# EasyEDA schematic table2.json
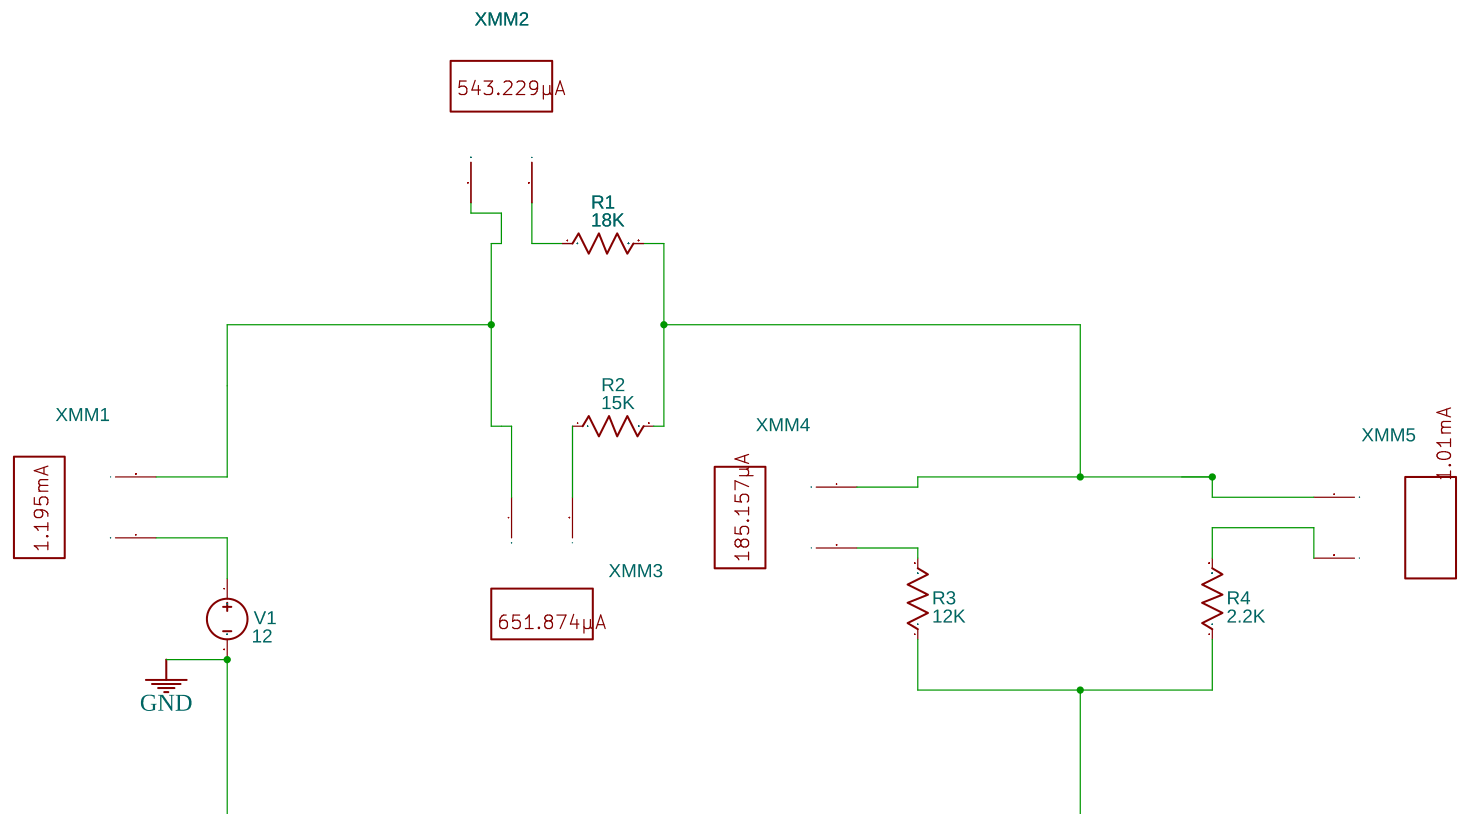
[diagram p0: schematic sheet]

## Parts
R1  18K  [AXIAL-0.3]
R2  15K  [AXIAL-0.3]
R3  12K  [AXIAL-0.3]
R4  2.2K  [AXIAL-0.3]
V1  12  [HDR1X2]
XMM1  Multimeter
XMM2  Multimeter
XMM3  Multimeter
XMM4  Multimeter
XMM5  Multimeter

## Library data of the parts
R1-R4 = Resistor_US: Resistance: 1k; Contributor: EasyEDA; Supplier: YUJING
V1 = VDC: Contributor: EasyEDA; sim: true
XMM1-XMM5 = MULTIMETER: Supplier: LCSC; Multimeter Type: Amper; Power Type: AC; Voltmeter resistance: 10μ; Ammeter resistance: 1G; NameDisplay: 0; Contributor: EasyEDA; sim: true

## Nets
GND: R3.1 R4.1 V1.2
Net-(R1-1): R1.1 XMM2.2(I)
Net-(R1-2): R1.2 R2.2 XMM4.1(+) XMM5.1(+)
Net-(R2-1): R2.1 XMM3.2(I)
Net-(R3-2): R3.2 XMM4.2(I)
Net-(R4-2): R4.2 XMM5.2(I)
Net-(V1-1): V1.1 XMM1.1(+)
Net-(XMM1-2): XMM1.2(I) XMM2.1(+) XMM3.1(+)

## Notes on the sheet
- .tran 10m
